# Altium schematic sheet AirScout_SchematicsV2.0.SchDoc
size A3; SheetNumber: 1; SheetTotal: 1
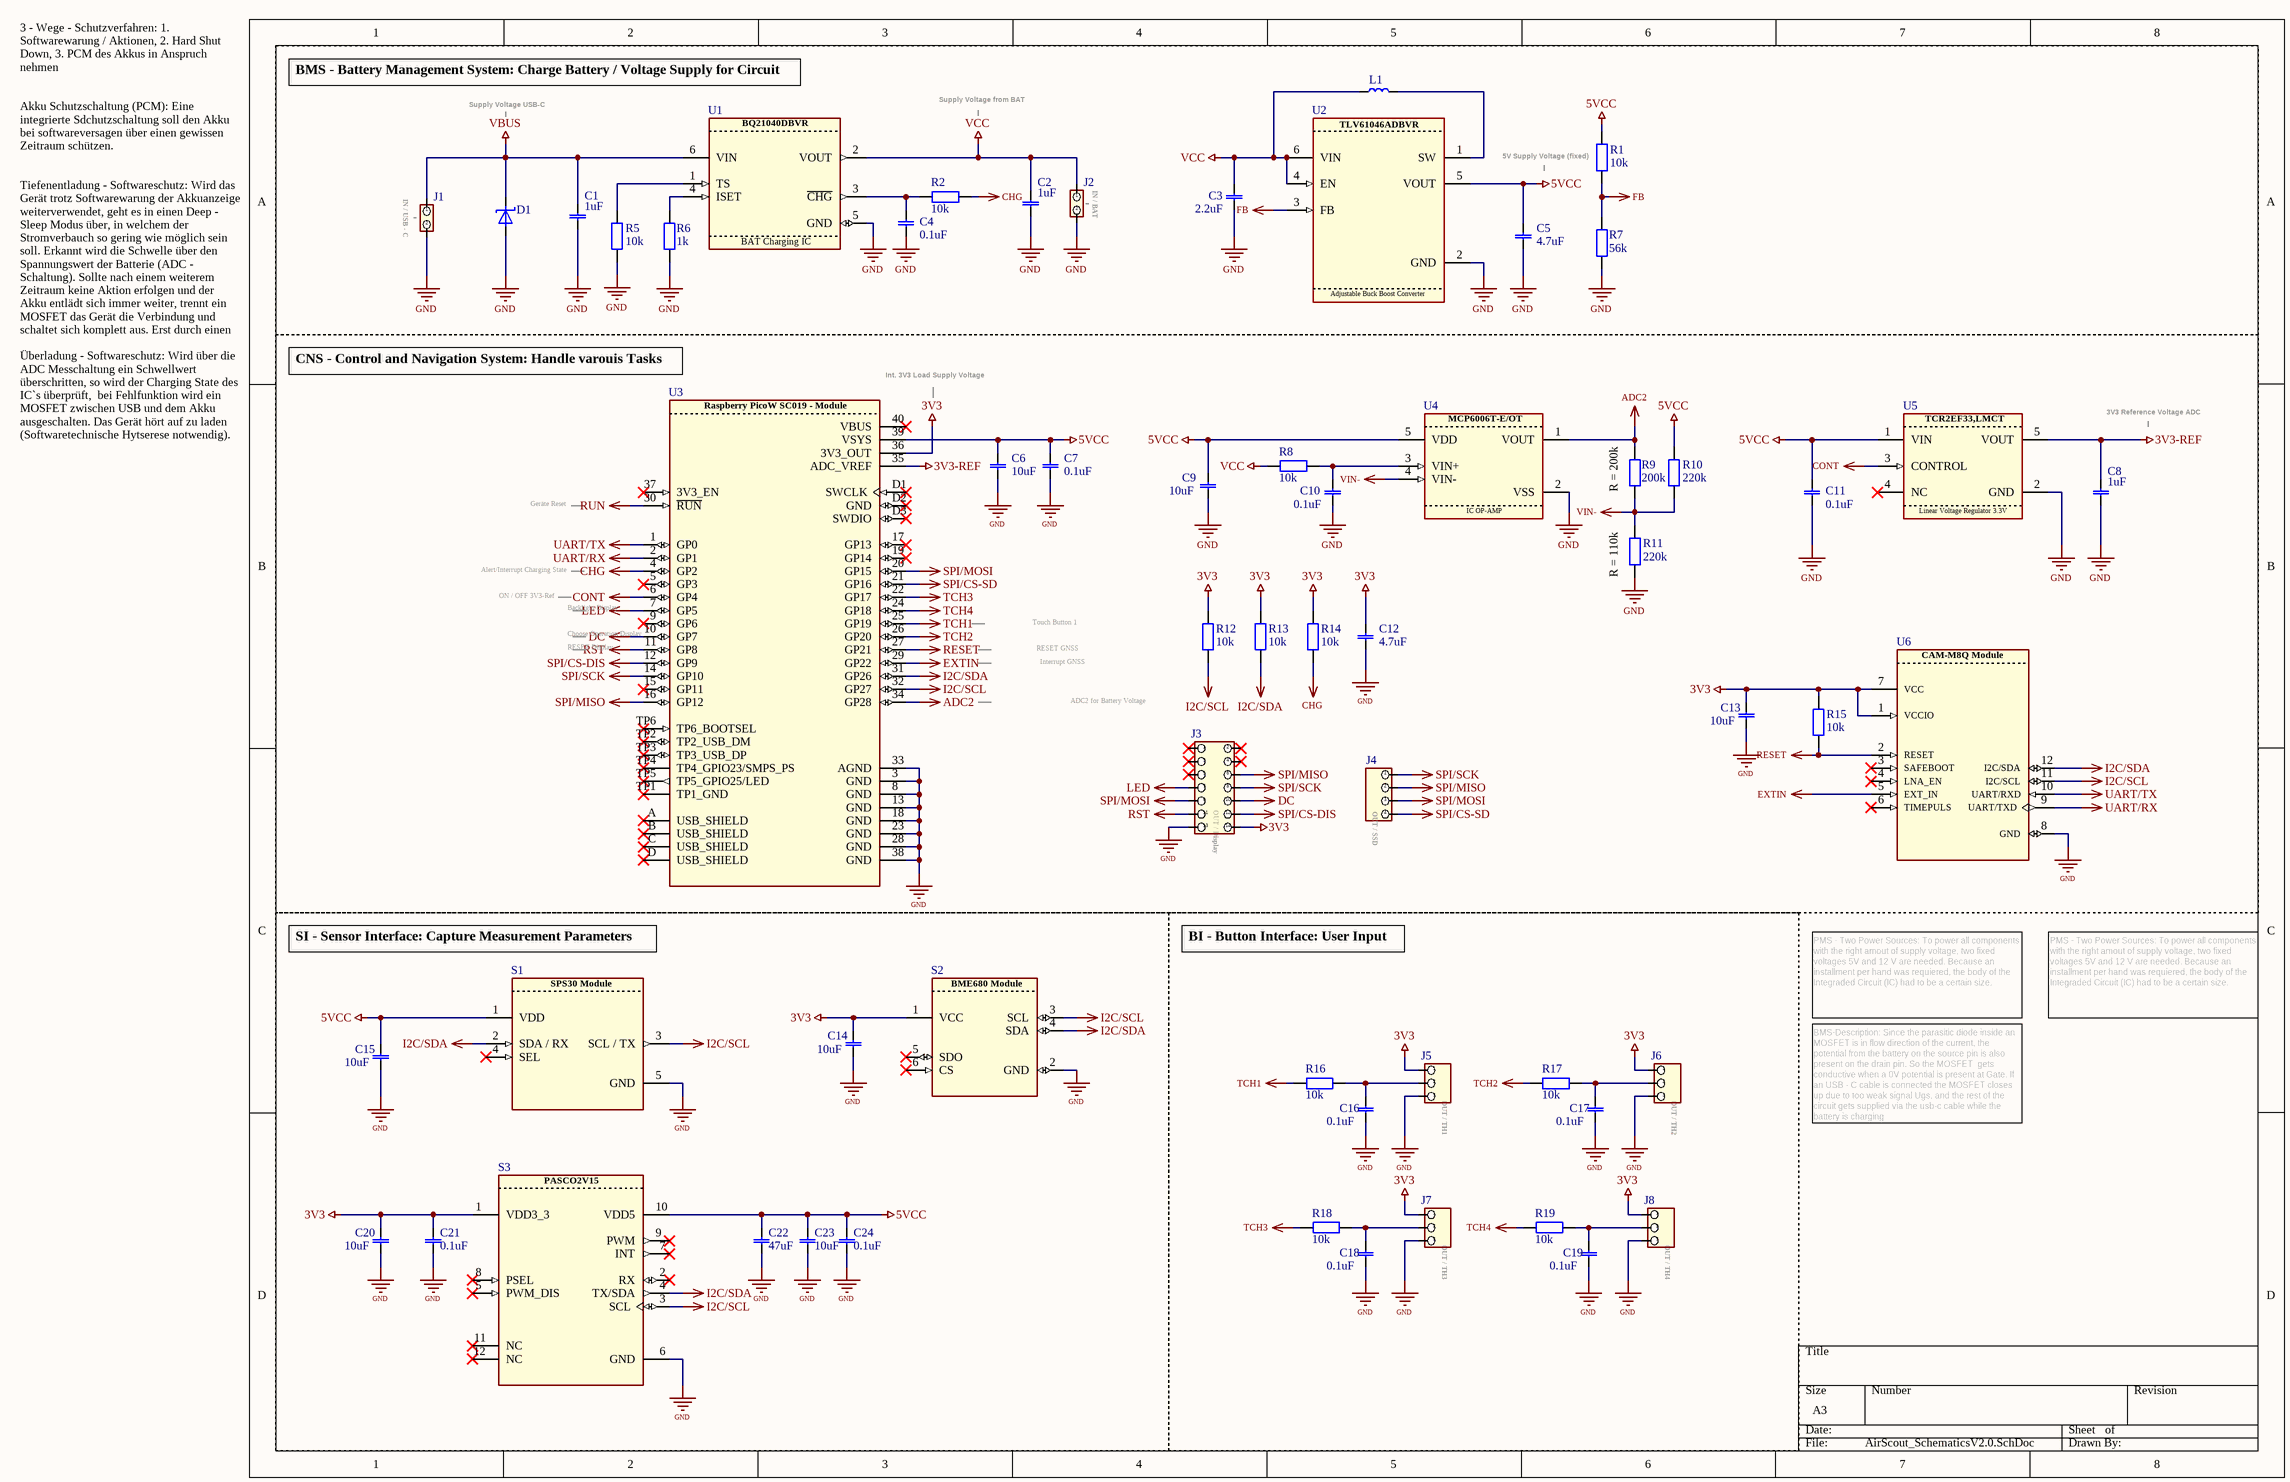
[diagram p0: AirScout_SchematicsV2.0.SchDoc]

## Parts
C1  value 1uF  [CAPC340180_140N_KEM]  (hidden comment: C1206C105K3RACTU)
C2  value 1uF  [CAPC340180_140N_KEM]  (hidden comment: C1206C105K3RACTU)
C3  value 2.2uF  [CAPC340180_140N_KEM]  (hidden comment: CL31B225KBHNNNE)
C4  value 0.1uF  [CAPC340180_140N_KEM]  (hidden comment: C1206C104K5RACTU)
C5  value 4.7uF  [CAPC340180_140N_KEM]  (hidden comment: CL31B475KBHNFNE)
C6  value 10uF  [CAPC340180_140N_KEM]  (hidden comment: CL31B106KAHNNNE)
C7  value 0.1uF  [CAPC340180_140N_KEM]  (hidden comment: C1206C104K5RACTU)
C8  value 1uF  [CAPC340180_140N_KEM]  (hidden comment: C1206C105K3RACTU)
C9  value 10uF  [CAPC340180_140N_KEM]  (hidden comment: CL31B106KAHNNNE)
C10  value 0.1uF  [CAPC340180_140N_KEM]  (hidden comment: C1206C104K5RACTU)
C11  value 0.1uF  [CAPC340180_140N_KEM]  (hidden comment: C1206C104K5RACTU)
C12  value 4.7uF  [CAPC340180_140N_KEM]  (hidden comment: CL31B475KBHNFNE)
C13  value 10uF  [CAPC340180_140N_KEM]  (hidden comment: CL31B106KAHNNNE)
C14  value 10uF  [CAPC340180_140N_KEM]  (hidden comment: CL31B106KAHNNNE)
C15  value 10uF  [CAPC340180_140N_KEM]  (hidden comment: CL31B106KAHNNNE)
C16  value 0.1uF  [CAPC340180_140N_KEM]  (hidden comment: C1206C104K5RACTU)
C17  value 0.1uF  [CAPC340180_140N_KEM]  (hidden comment: C1206C104K5RACTU)
C18  value 0.1uF  [CAPC340180_140N_KEM]  (hidden comment: C1206C104K5RACTU)
C19  value 0.1uF  [CAPC340180_140N_KEM]  (hidden comment: C1206C104K5RACTU)
C20  value 10uF  [CAPC340180_140N_KEM]  (hidden comment: CL31B106KAHNNNE)
C21  value 0.1uF  [CAPC340180_140N_KEM]  (hidden comment: C1206C104K5RACTU)
C22  value 47uF  [CAPC340180_140N_KEM]  (hidden comment: CL31A476MQHNNNE)
C23  value 10uF  [CAPC340180_140N_KEM]  (hidden comment: CL31B106KAHNNNE)
C24  value 0.1uF  [CAPC340180_140N_KEM]  (hidden comment: C1206C104K5RACTU)
D1  SMBJ14CA-13-F  [SMB_DIO]  (value not drawn)
J1  B02B-PASK-1  [CONN_S2B-PH-K-S_JST]  (value not drawn)
J2  B02B-PASK-1  [CONN_S2B-PH-K-S_JST]  (value not drawn)
J3  IDMS-14-D-02.00-R  [CONN_14POL_SAMTEC]  (value not drawn)
J4  IDMS-4-D-02.00-R  [SAMTEC_IDMS-04-S-02.00]  (value not drawn)
J5  IDMS-3-D-02.00-R  [CONN_3POL_SAMTEC]  (value not drawn)
J6  IDMS-3-D-02.00-R  [CONN_3POL_SAMTEC]  (value not drawn)
J7  IDMS-3-D-02.00-R  [CONN_3POL_SAMTEC]  (value not drawn)
J8  IDMS-3-D-02.00-R  [CONN_3POL_SAMTEC]  (value not drawn)
L1  PA4332.103NLT  [IND_FDSD0420-H-100M=P3]  (value not drawn)
R1  value 10k  [RESC3116X65N]  (hidden comment: RC1206FR-0710KL)
R2  value 10k  [RESC3116X65N]  (hidden comment: RC1206FR-0710KL)
R5  value 10k  [RESC3116X65N]  (hidden comment: RC1206FR-0710KL)
R6  value 1k  [RESC3116X65N]  (hidden comment: RNCP1206FTD1K00)
R7  value 56k  [RESC3116X65N]  (hidden comment: RMCF1206JT56K0)
R8  value 10k  [RESC3116X65N]  (hidden comment: RC1206FR-0710KL)
R9  value 200k  [RESC3116X65N]  (hidden comment: RC1206JR-07200KL)
R10  value 220k  [RESC3116X65N]  (hidden comment: RC1206JR-07220KL)
R11  value 220k  [RESC3116X65N]  (hidden comment: RC1206JR-07220KL)
R12  value 10k  [RESC3116X65N]  (hidden comment: RC1206FR-0710KL)
R13  value 10k  [RESC3116X65N]  (hidden comment: RC1206FR-0710KL)
R14  value 10k  [RESC3116X65N]  (hidden comment: RC1206FR-0710KL)
R15  value 10k  [RESC3116X65N]  (hidden comment: RC1206FR-0710KL)
R16  value 10k  [RESC3116X65N]  (hidden comment: RC1206FR-0710KL)
R17  value 10k  [RESC3116X65N]  (hidden comment: RC1206FR-0710KL)
R18  value 10k  [RESC3116X65N]  (hidden comment: RC1206FR-0710KL)
R19  value 10k  [RESC3116X65N]  (hidden comment: RC1206FR-0710KL)
S1  B5B-ZR  [CONN5_B5B-ZR_JST]  (value not drawn)
S2  NPPC061KFXC-RC  [PIM357]  (value not drawn)
S3  NPPC061KFXC-RC  [IFX-SMD-LG-MLGA-14-1-V_MODUL]  (value not drawn)
U1  BQ21040DBVR  [SOT95P280X145-6N]  (value not drawn)
U2  TLV61046ADBVR  [DBV0006A_M]  (value not drawn)
U3  SSM-120-L-SV-BE-K-TR  [PicoW SC019]  (value not drawn)
U4  MCP6006T-E/OT  [SOT23-5-AP2202K_DIO-M]  (value not drawn)
U5  TCR2EF33,LM(CT  [SOT-25   SMV_TOS]  (value not drawn)
U6  NPPC061KFXC-RC  [CAM8MQ-Mod]  (value not drawn)

## Blocks framed on the sheet
CNS - Control and Navigation System: Handle varouis Tasks: C6-C13 J3 J4 R8-R15 U3-U6
SI - Sensor Interface: Capture Measurement Parameters: C14 C15 C20-C24 S1-S3
BI - Button Interface: User Input: C16-C19 J5-J8 R16-R19

## Nets
3V3: C12.2 C13.2 C14.2 C20.2 C21.2 J3.14 J5.1 J6.1 J7.1 J8.1 R12.2 R13.2 R14.2 R15.2 S2.1(VCC) S3.1(VDD3_3) U3.36(3V3_OUT) U6.1(VCCIO) U6.7(VCC)
3V3-REF: C8.2 U3.35(ADC_VREF) U5.5(VOUT)
5VCC: C5.2 C6.2 C7.2 C9.2 C11.2 C15.2 C22.2 C23.2 C24.2 R1.2 R10.2 S1.1(VDD) S3.10(VDD5) U2.5(VOUT) U3.39(VSYS) U4.5(VDD) U5.1(VIN)
ADC2: R9.2 U3.34(GP28) U4.1(VOUT)
CHG: R2.1 R14.1 U3.4(GP2)
CONT: U3.6(GP4) U5.3(CONTROL)
DC: J3.10 U3.10(GP7)
EXTIN: U3.29(GP22) U6.5(EXT_IN)
FB: R1.1 R7.2 U2.3(FB)
GND: C1.1 C2.1 C3.1 C4.1 C5.1 C6.1 C7.1 C8.1 C9.1 C10.1 C11.1 C12.1 C13.1 C14.1 C15.1 C16.1 C17.1 C18.1 C19.1 C20.1 C21.1 C22.1 C23.1 C24.1 D1.A J1.2(-) J2.2(-) J3.13 J5.3 J6.3 J7.3 J8.3 R5.1 R6.1 R7.1 R11.1 S1.5(GND) S2.2(GND) S3.6(GND) U1.5(GND) U2.2(GND) U3.3(GND) U3.8(GND) U3.13(GND) U3.18(GND) U3.23(GND) U3.28(GND) U3.33(AGND) U3.38(GND) U4.2(VSS) U5.2(GND) U6.8(GND)
I2C/SCL: R12.1 S1.3(SCL_/_TX) S2.3(SCL) S3.3(SCL) U3.32(GP27) U6.11(I2C/SCL)
I2C/SDA: R13.1 S1.2(SDA_/_RX) S2.4(SDA) S3.4(TX/SDA) U3.31(GP26) U6.12(I2C/SDA)
LED: J3.7 U3.7(GP5)
RESET: R15.1 U3.27(GP21) U6.2(RESET)
RST: J3.11 U3.11(GP8)
RUN: U3.30(~{RUN})
SPI/CS-DIS: J3.12 U3.12(GP9)
SPI/CS-SD: J4.4 U3.21(GP16)
SPI/MISO: J3.6 J4.2 U3.16(GP12)
SPI/MOSI: J3.9 J4.3 U3.20(GP15)
SPI/SCK: J3.8 J4.1 U3.14(GP10)
TCH1: R16.2 U3.25(GP19)
TCH2: R17.2 U3.26(GP20)
TCH3: R18.2 U3.22(GP17)
TCH4: R19.2 U3.24(GP18)
UART/RX: U3.2(GP1) U6.9(UART/TXD)
UART/TX: U3.1(GP0) U6.10(UART/RXD)
VBUS: C1.2 D1.K J1.1(+) U1.6(VIN)
VCC: C2.2 C3.2 J2.1(+) L1.1 R8.2 U1.2(VOUT) U2.4(EN) U2.6(VIN)
VIN-: R9.1 R10.1 R11.2 U4.4(VIN-)
NetC4_2: C4.2 R2.2 U1.3(~{CHG})
NetC10_2: C10.2 R8.1 U4.3(VIN+)
NetC16_2: C16.2 J5.2 R16.1
NetC17_2: C17.2 J6.2 R17.1
NetC18_2: C18.2 J7.2 R18.1
NetC19_2: C19.2 J8.2 R19.1
NetL1_2: L1.2 U2.1(SW)
NetR5_2: R5.2 U1.1(TS)
NetR6_2: R6.2 U1.4(ISET)

Not connected (* = marked no-connect by the designer): J3 1* 2* 3* 4* 5*; S1 4(SEL)*; S2 5(SDO)* 6(CS)*; S3 2(RX)* 5(PWM_DIS)* 7(INT)* 8(PSEL)* 9(PWM)* 11(NC)* 12(NC)*; U3 5(GP3)* 9(GP6)* 15(GP11)* 17(GP13)* 19(GP14)* 37(3V3_EN)* 40(VBUS)* A(USB_SHIELD)* B(USB_SHIELD)* C(USB_SHIELD)* D(USB_SHIELD)* D1(SWCLK)* D2(GND)* D3(SWDIO)* TP1(TP1_GND)* TP2(TP2_USB_DM)* TP3(TP3_USB_DP)* TP4(TP4_GPIO23/SMPS_PS)* TP5(TP5_GPIO25/LED)* TP6(TP6_BOOTSEL)*; U5 4(NC)*; U6 3(SAFEBOOT)* 4(LNA_EN)* 6(TIMEPULS)*

## Notes on the sheet
- 3 - Wege - Schutzverfahren: 1. Softwarewarung / Aktionen, 2. Hard Shut Down, 3. PCM des Akkus in Anspruch nehmen
- BMS - Battery Management System: Charge Battery / Voltage Supply for Circuit
- Supply Voltage USB-C
- Supply Voltage from BAT
- Akku Schutzschaltung (PCM): Eine integrierte Sdchutzschaltung soll den Akku bei softwareversagen über einen gewissen Zeitraum schützen.
- (near J2) IN / BAT
- (near R1) 5V Supply Voltage (fixed)
- (near J1) IN / USB - C
- Tiefenentladung - Softwareschutz: Wird das Gerät trotz Softwarewarung der Akkuanzeige weiterverwendet, geht es in einen Deep - Sleep Modus über, in welchem der Stromverbauch so gering wie möglich sein soll. Erkannt wird die Schwelle über den Spannungswert der Batterie (ADC - Schaltung). Sollte nach einem weiterem Zeitraum keine Aktion erfolgen und der Akku entlädt sich immer weiter, trennt ein MOSFET das Gerät die Verbindung und schaltet sich komplett aus. Erst durch einen USB - Impuls erwacht es wieder.
- (near U3) Int. 3V3 Load Supply Voltage
- Überladung - Softwareschutz: Wird über die ADC Messchaltung ein Schwellwert überschritten, so wird der Charging State des IC`s überprüft,  bei Fehlfunktion wird ein MOSFET zwischen USB und dem Akku ausgeschalten. Das Gerät hört auf zu laden (Softwaretechnische Hytserese notwendig).
- 3V3 Reference Voltage ADC
- Geräte Reset
- (near R9) R = 200k
- Alert/Interrupt Charging State
- (near R11) R = 110k
- ON / OFF 3V3-Ref
- Choose Operation Display
- RESET Display
- Backlight Display
- Touch Button 1
- RESET GNSS
- Interrupt GNSS
- ADC2 for Battery Voltage
- (near J3) OUT / Display
- (near J4) OUT / SSD
- PMS - Two Power Sources: To power all components with the right amout of supply voltage, two fixed voltages 5V and 12 V are needed. Because an installment per hand was requiered, the body of the Integraded Circuit (IC) had to be a certain size.
- (near J5) OUT / TH1
- (near J6) OUT / TH2
- BMS-Description: Since the parasitic diode inside an MOSFET is in flow direction of the current, the potential from the battery on the source pin is also present on the drain pin. So the MOSFET  gets conductive when a 0V potential is present at Gate. If an USB - C cable is connected the MOSFET closes up due to too weak signal Ugs, and the rest of the circuit gets supplied via the usb-c cable while the battery is charging
- (near J7) OUT / TH3
- (near J8) OUT / TH4
- (in symbol BQ21040DBVR) BAT Charging IC
- (in symbol MCP6006T-E/OT) IC OP-AMP
- (in symbol PASCO2V15 Module) PASCO2V15
- (in symbol Raspberry PicoW SC019 Module) Raspberry PicoW SC019 - Module
- (in symbol TCR2EF33,LMCT) Linear Voltage Regulator 3.3V
- (in symbol TLV61046ADBVR) Adjustable Buck Boost Converter

## Library data of the parts
C1 C2 C8 = CAP: CAP CER 1UF 25V X7R 1206
C3 = CAP: CAP CER 2.2UF 50V X7R 1206
C4 C7 C10 C11 C16-C19 C21 C24 = CAP: CAP CER 0.1UF 50V X7R 1206
C5 C12 = CAP: CAP CER 4.7UF 50V X7R 1206
C6 C9 C13-C15 C20 C23 = CAP: CAP CER 10UF 25V X7R 1206
C22 = CAP: CAP CER 47UF 6.3V X5R 1206
D1 = Diode-Schottky: TVS DIODE 14VWM 23.2VC SMB
J1 J2 = CON2x1_vertical: CONN HEADER VERT 2POS 2MM
J3 = CON7x2: Alternitives: IDMS-14-D-03.00, IDMS-14-D-02.00, IDMS-14-D-03.00-R
J4 = CON 4x1: Alternitives:  IDMS-4-D-03.00, IDMS-4-D-02.00, IDMS-4-D-03.00-R
J5-J8 = CON 3x1: Alternitives:  IDMS-3-D-03.00, IDMS-3-D-02.00, IDMS-3-D-03.00-R
L1 = Inductor: FIXED IND 10UH 2A 216 MOHM SMD; / AIUR-05-100K; Value: *
R1 R2 R5 R8 R12-R19 = RES: RES 10K OHM 1% 1/4W 1206
R6 = RES: RES 1K OHM 1% 1/2W 1206
R7 = RES: RES 56K OHM 5% 1/4W 1206
R9 = RES: RES 200K OHM 5% 1/4W 1206
R10 R11 = RES: RES 220K OHM 5% 1/4W 1206
S1 = SPS30 Module: Plug: CONN HEADER VERT 5POS 1.5MM; Air Sensor Dust Sensor Box SPS30 Module: 1649-1106-ND; ComponentLink1Description: Datasheet; ComponentLink1URL: https://sensirion.com/media/documents/8600FF88/64A3B8D6/Sensirion_PM_Sensors_Datasheet_SPS30.pdf; ComponentLink2Description: EU Component; ComponentLink2URL: https://www.digikey.at/en/products/detail/sensirion-ag/SPS30/9598990?gclsrc=aw.ds&gad_source=1&gad_campaignid=9415055229&gbraid=0AAAAADrbLlghU28cdFM9RQIiS448Os4NQ&gclid=Cj0KCQjwzt_FBhCEARIsAJGFWVladtv1vxGMu0RXHFTM9ng6qsDvV838Q-BR2Fl5FYFzWahIkC0y_aYaAqE3EALw_wcB
S2 = BME680 Module: Header: CONN HDR 6POS 0.1 GOLD SMD; Sensor: EVAL BOARD BME680 SENSOR - Gas, Feuchtigkeit, Druck, Temperatur Evaluierungsboards - Sensoren; ComponentLink1Description: Datasheet; ComponentLink1URL: chrome-extension://efaidnbmnnnibpcajpcglclefindmkaj/https://mm.digikey.com/Volume0/opasdata/d220001/medias/docus/854/PIM357_Web.pdf
S3 = PASCO2V15 Module: (2x) CONN RCPT 6POS 0.1 GOLD SMD; Sensor: EVALCO25VMINIBOARDTOBO1; EVAL BOARD; Symbol Type: XENSIV PAS CO2 1.5; Alternate View: No; Multiple Parts: No; ComponentLink1Description: Datasheet; ComponentLink1URL: chrome-extension://efaidnbmnnnibpcajpcglclefindmkaj/https://www.infineon.com/assets/row/public/documents/24/49/infineon-pasco2v01-datasheet-en.pdf?fileId=8ac78c8c80027ecd01809278f1af1ba2
U1 = BQ21040DBVR: OVP (Over-Voltage-Protection), SCP (Short-Circuit- Protection), OTP (Over - Temp. - Prot.); 1-cell, 0.8-A Li-ion and Li-polymer battery charger; MF: Texas Instruments; SnapEDA_Link: https://www.snapeda.com/parts/BQ21040DBVR/Texas+Instruments/view-part/?ref=snap; Package: SOT-23-6 Texas Instruments; Value: *; MP: BQ21040DBVR; Check_prices: https://www.snapeda.com/parts/BQ21040DBVR/Texas+Instruments/view-part/?ref=eda
U2 = TLV61046ADBVR: 28-V Output Voltage Boost Converter with Power Diode and Isolation Switch 6-SOT-23 -40 to 125; Manufacturer_Name: Texas Instruments; TYPE: TYPE; RefDes: RefDes; Copyright: Copyright (C) 2025 Ultra Librarian. All rights reserved.; Manufacturer_Part_Number: TLV61046ADBVR
U3 = Raspberry PicoW SC019 Module: (2x) CONN RCPT 20POS 0.1 GOLD SMD; PicoW: SC0918; RASPBERRY PI PICO W RP2040; ComponentLink1Description: EU Component; ComponentLink1URL: https://www.reichelt.at/at/de/shop/produkt/raspberry_pi_pico_rp2040_cortex-m0_microusb-295706; ComponentLink2Description: Datasheet; ComponentLink2URL: chrome-extension://efaidnbmnnnibpcajpcglclefindmkaj/https://datasheets.raspberrypi.com/picow/pico-w-datasheet.pdf
U4 = MCP6006T-E/OT: IC OPAMP GP 1 CIRCUIT SOT23-5
U5 = TCR2EF33,LMCT: IC REG LINEAR 3.3V 200MA SMV; Manufacturer_Name: Toshiba Electronic Devices & Storage Corp.; Copyright: Copyright (C) 2025 Ultra Librarian. All rights reserved.; Manufacturer_Part_Number: TCR2EF33,LM(CT; RefDes: RefDes; Type: Type
U6 = CAM-M8Q Module: (2x) CONN HDR 6POS 0.1 GOLD SMD; GPS - Module:  201880; CAM-M8Q-BREAKOUT MULTI GNSS MODU; ComponentLink1Description: Datasheet IC; ComponentLink1URL: chrome-extension://efaidnbmnnnibpcajpcglclefindmkaj/https://content.u-blox.com/sites/default/files/CAM-M8-FW3_DataSheet_%28UBX-15031574%29.pdf